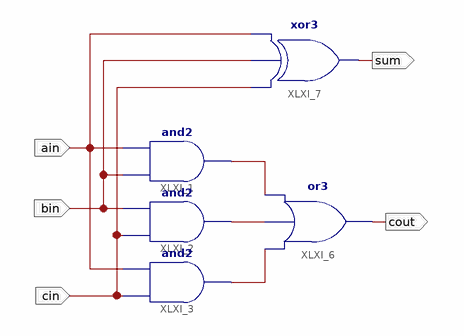
[diagram p0: schematic sheet 1]
// Xilinx ISE schematic full_adder.sch (spartan3e) as structural Verilog: 5 symbols, 5 ports
module full_adder (
  input  ain,
  input  bin,
  input  cin,
  output sum,
  output cout
);

  wire XLXN_1, XLXN_2, XLXN_3;

  and XLXI_1 (XLXN_1, bin, ain);
  and XLXI_2 (XLXN_2, cin, bin);
  and XLXI_3 (XLXN_3, cin, ain);
  or XLXI_6 (cout, XLXN_3, XLXN_2, XLXN_1);
  xor XLXI_7 (sum, cin, bin, ain);
endmodule
